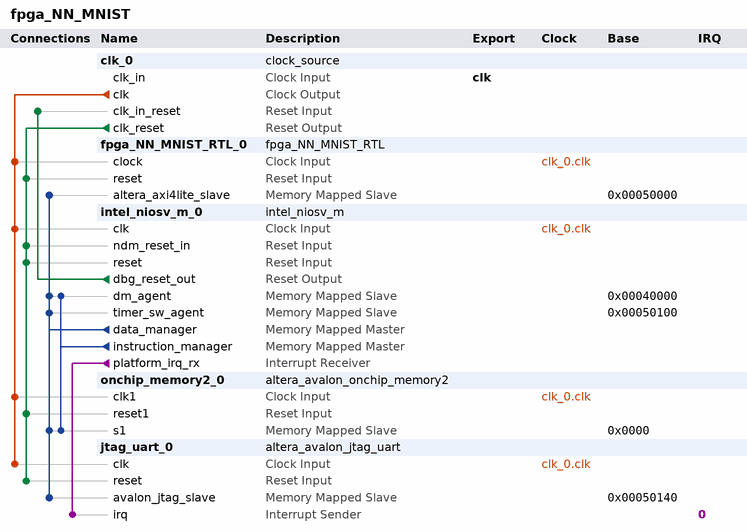
[diagram p0: system contents]
# Platform Designer (Qsys) system fpga_NN_MNIST, Cyclone V 5CSXFC6D6F31C6
# Parameters at their usual value, and those the tool derives, are not listed.
package require -exact qsys 25.1
create_system fpga_NN_MNIST
set_project_property DEVICE_FAMILY {Cyclone V}
set_project_property DEVICE 5CSXFC6D6F31C6

add_instance clk_0 clock_source 25.1
set_instance_parameter_value clk_0 clockFrequency 50000000

add_instance fpga_NN_MNIST_RTL_0 fpga_NN_MNIST_RTL 1.0
set_instance_parameter_value fpga_NN_MNIST_RTL_0 ACC_TYPE reLU
set_instance_parameter_value fpga_NN_MNIST_RTL_0 AXI_ADDR_READ_PROT_WIDTH 3
set_instance_parameter_value fpga_NN_MNIST_RTL_0 AXI_ADDR_WIDTH 8
set_instance_parameter_value fpga_NN_MNIST_RTL_0 AXI_ADDR_WRITE_PROT_WIDTH 3
set_instance_parameter_value fpga_NN_MNIST_RTL_0 AXI_READ_DATA_WIDTH 32
set_instance_parameter_value fpga_NN_MNIST_RTL_0 AXI_READ_RESPONSE_WIDTH 2
set_instance_parameter_value fpga_NN_MNIST_RTL_0 AXI_WRITE_DATA_WIDTH 32
set_instance_parameter_value fpga_NN_MNIST_RTL_0 AXI_WRITE_RESPONSE_WIDTH 2
set_instance_parameter_value fpga_NN_MNIST_RTL_0 AXI_WRITE_STROBE_WIDTH 4
set_instance_parameter_value fpga_NN_MNIST_RTL_0 DATA_WIDTH 16
set_instance_parameter_value fpga_NN_MNIST_RTL_0 N_NETWORK_INPUTS 784
set_instance_parameter_value fpga_NN_MNIST_RTL_0 N_NEURONS_LAYER_1 64
set_instance_parameter_value fpga_NN_MNIST_RTL_0 N_NEURONS_LAYER_2 64
set_instance_parameter_value fpga_NN_MNIST_RTL_0 N_NEURONS_LAYER_3 10
set_instance_parameter_value fpga_NN_MNIST_RTL_0 SIGMOID_INPUT_WIDTH 5

add_instance intel_niosv_m_0 intel_niosv_m 26.0.0
set_instance_parameter_value intel_niosv_m_0 enableAvalonInterface false
set_instance_parameter_value intel_niosv_m_0 enableDebugReset true
set_instance_parameter_value intel_niosv_m_0 enableECCFull false
set_instance_parameter_value intel_niosv_m_0 enableECCLite false
set_instance_parameter_value intel_niosv_m_0 hartId 0
set_instance_parameter_value intel_niosv_m_0 interruptMode 0
set_instance_parameter_value intel_niosv_m_0 pipelineArch true
set_instance_parameter_value intel_niosv_m_0 resetSlave Absolute

add_instance onchip_memory2_0 altera_avalon_onchip_memory2 25.1
set_instance_parameter_value onchip_memory2_0 dataWidth 32
set_instance_parameter_value onchip_memory2_0 dualPort false
set_instance_parameter_value onchip_memory2_0 initMemContent true
set_instance_parameter_value onchip_memory2_0 initializationFileName onchip_mem.hex
set_instance_parameter_value onchip_memory2_0 memorySize 262144

add_instance jtag_uart_0 altera_avalon_jtag_uart 25.1
set_instance_parameter_value jtag_uart_0 simInteractiveOptions NO_INTERACTIVE_WINDOWS

# connections
add_connection clk_0.clk fpga_NN_MNIST_RTL_0.clock clock
add_connection clk_0.clk intel_niosv_m_0.clk clock
add_connection clk_0.clk jtag_uart_0.clk clock
add_connection clk_0.clk onchip_memory2_0.clk1 clock
add_connection clk_0.clk_reset fpga_NN_MNIST_RTL_0.reset reset
add_connection clk_0.clk_reset intel_niosv_m_0.ndm_reset_in reset
add_connection clk_0.clk_reset intel_niosv_m_0.reset reset
add_connection clk_0.clk_reset jtag_uart_0.reset reset
add_connection clk_0.clk_reset onchip_memory2_0.reset1 reset
add_connection intel_niosv_m_0.dbg_reset_out clk_0.clk_in_reset reset
add_connection intel_niosv_m_0.data_manager fpga_NN_MNIST_RTL_0.altera_axi4lite_slave avalon
set_connection_parameter_value intel_niosv_m_0.data_manager/fpga_NN_MNIST_RTL_0.altera_axi4lite_slave baseAddress 0x00050000
add_connection intel_niosv_m_0.data_manager intel_niosv_m_0.dm_agent avalon
set_connection_parameter_value intel_niosv_m_0.data_manager/intel_niosv_m_0.dm_agent baseAddress 0x00040000
add_connection intel_niosv_m_0.data_manager intel_niosv_m_0.timer_sw_agent avalon
set_connection_parameter_value intel_niosv_m_0.data_manager/intel_niosv_m_0.timer_sw_agent baseAddress 0x00050100
add_connection intel_niosv_m_0.data_manager jtag_uart_0.avalon_jtag_slave avalon
set_connection_parameter_value intel_niosv_m_0.data_manager/jtag_uart_0.avalon_jtag_slave baseAddress 0x00050140
add_connection intel_niosv_m_0.data_manager onchip_memory2_0.s1 avalon
set_connection_parameter_value intel_niosv_m_0.data_manager/onchip_memory2_0.s1 baseAddress 0x0000
add_connection intel_niosv_m_0.instruction_manager intel_niosv_m_0.dm_agent avalon
set_connection_parameter_value intel_niosv_m_0.instruction_manager/intel_niosv_m_0.dm_agent baseAddress 0x00040000
add_connection intel_niosv_m_0.instruction_manager onchip_memory2_0.s1 avalon
set_connection_parameter_value intel_niosv_m_0.instruction_manager/onchip_memory2_0.s1 baseAddress 0x0000
add_connection intel_niosv_m_0.platform_irq_rx jtag_uart_0.irq interrupt
set_connection_parameter_value intel_niosv_m_0.platform_irq_rx/jtag_uart_0.irq irqNumber 0

# exported interfaces
add_interface clk clock sink
set_interface_property clk EXPORT_OF clk_0.clk_in

set_interconnect_requirement {$system} qsys_mm.clockCrossingAdapter HANDSHAKE
set_interconnect_requirement {$system} qsys_mm.enableEccProtection FALSE
set_interconnect_requirement {$system} qsys_mm.insertDefaultSlave FALSE
set_interconnect_requirement {$system} qsys_mm.maxAdditionalLatency 1

save_system fpga_NN_MNIST.qsys
